# EAGLE schematic ANET3D-ISP-Adapter (EAGLE 6.6.0)
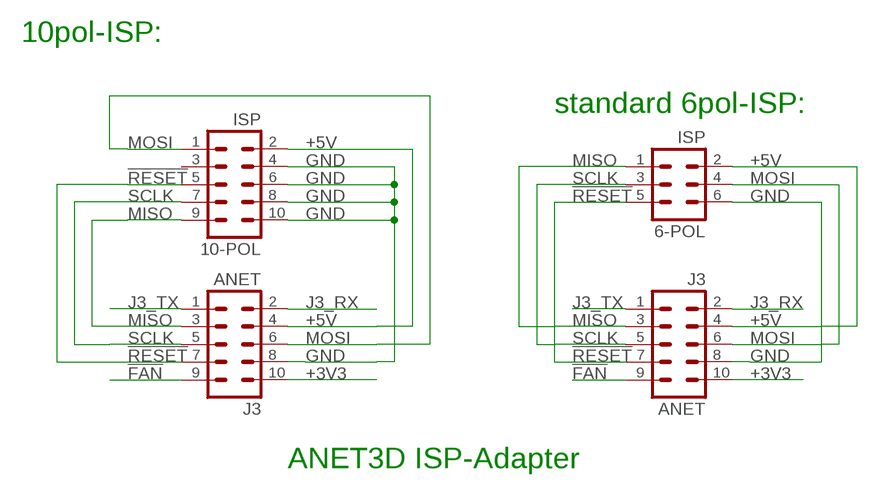
[diagram p0: schematic, sheet 1]

## Parts
6-POL  ISP  ML6  [ML6]
10-POL  ISP  ML10  [ML10]
ANET  J3  ML10  [ML10]
J3  ANET  ML10  [ML10]

## Nets
!FAN: ANET.9 J3.9
!RESET: 6-POL.5 10-POL.5 ANET.7 J3.7
+3V3: ANET.10 J3.10
+5V [power]: 6-POL.2 10-POL.2 ANET.4 J3.4
GND: 6-POL.6 10-POL.4 10-POL.6 10-POL.8 10-POL.10 ANET.8 J3.8
J3_RX: ANET.2 J3.2
J3_TX: ANET.1 J3.1
MISO: 6-POL.1 10-POL.9 ANET.3 J3.3
MOSI: 6-POL.4 10-POL.1 ANET.6 J3.6
SCLK: 6-POL.3 10-POL.7 ANET.5 J3.5
Unconnected: 10-POL.3

## Notes on the sheet
- 10pol-ISP:
- standard 6pol-ISP:
- ANET3D ISP-Adapter

## Library data of the parts
6-POL = con-harting-ml:ML6: HARTING; OC_FARNELL: unknown; OC_NEWARK: unknown
10-POL ANET J3 = con-harting-ml:ML10: HARTING; OC_FARNELL: unknown; OC_NEWARK: unknown